# Altium schematic sheet high_pass_filter.SchDoc
size A4
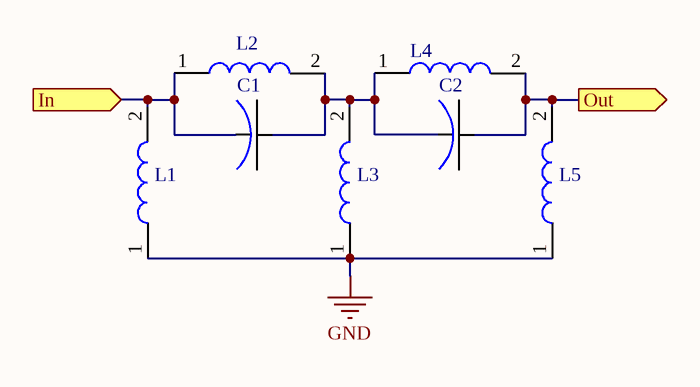
[diagram p0: high_pass_filter.SchDoc]

## Parts
L1  L1008  [L1008]  (value not drawn)
L2  L1812  [L1812]  (value not drawn)
L3  L1008  [L1008]  (value not drawn)
L4  L1812  [L1812]  (value not drawn)
L5  L1008  [L1008]  (value not drawn)
С1  Cap  [C1210]  (value not drawn)
С2  Cap  [C1206]  (value not drawn)

## Ports
In (in), Out (out)

## Nets
GND: L1.1 L3.1 L5.1
In: L1.2 L2.1 С1.1 ; port In
Out: L4.2 L5.2 С2.2 ; port Out
NetL2_2: L2.2 L3.2 L4.1 С1.2 С2.1

## Library data of the parts
L1 L3 L5 = L1008: Vishay IMC1008E2RJ7
L2 L4 = L1812: Vishay IMC1812ER150J